# EAGLE schematic COVERsation_v0.3 (EAGLE 7.6.0)
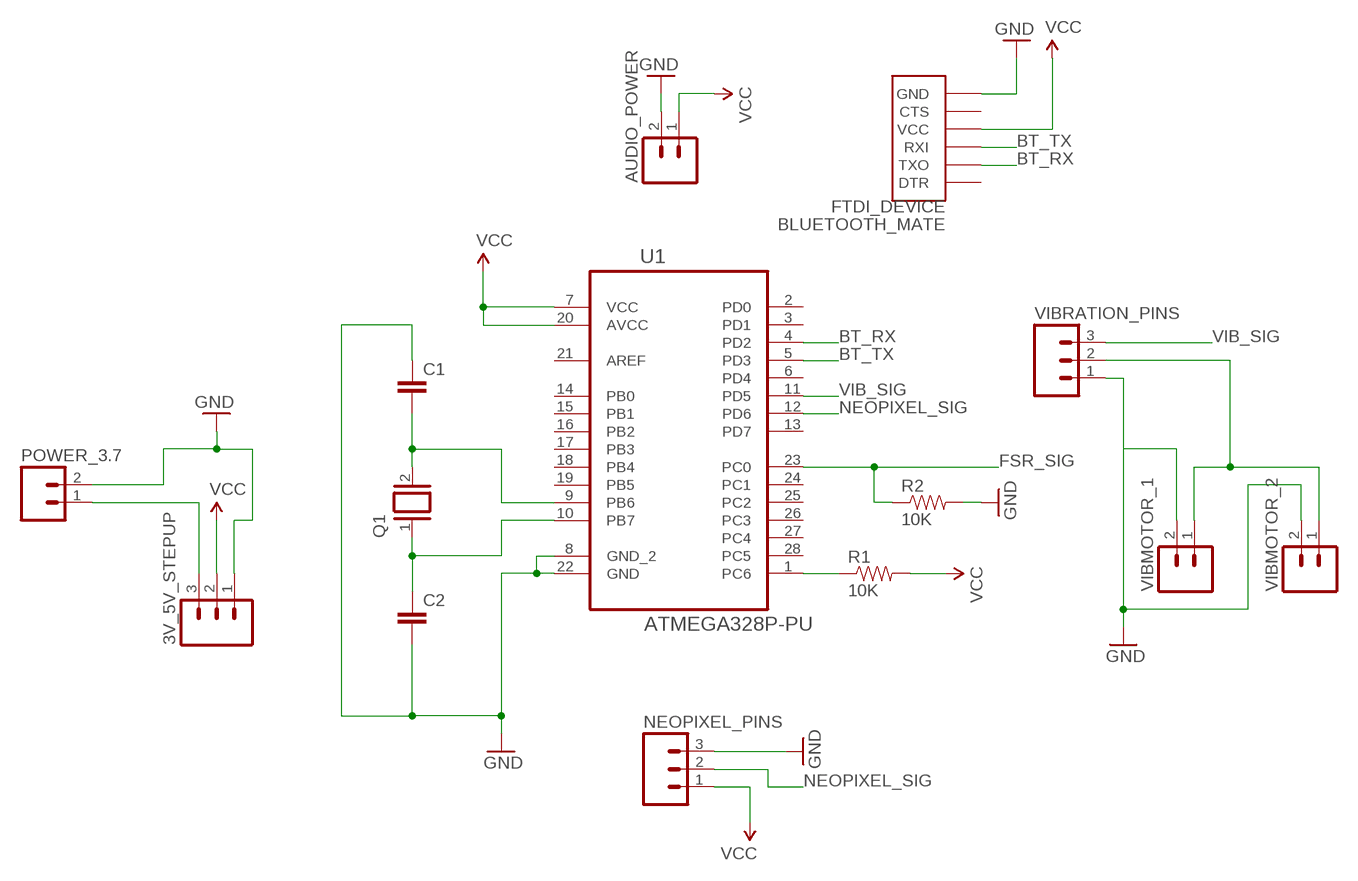
[diagram p0: schematic, sheet 1]

## Parts
3V_5V_STEPUP  M03PTH  [1X03]
AUDIO_POWER  M02PTH  [1X02]
BLUETOOTH_MATE  FTDI_DEVICE  [FTDI_DEVICE_SIDE]
C1  CAPPTH1  [CAP-PTH-5MM]
C2  CAPPTH1  [CAP-PTH-5MM]
NEOPIXEL_PINS  M03PTH  [1X03]
POWER_3.7  M02PTH  [1X02]
Q1  XTAL  [Q]
R1  10K  RESISTOREZ  [AXIAL-0.3EZ]
R2  10K  RESISTOREZ  [AXIAL-0.3EZ]
U1  ATMEGA328P-PU  [DIP254P762X457-28]
VIBMOTOR_1  M02PTH  [1X02]
VIBMOTOR_2  M02PTH  [1X02]
VIBRATION_PINS  M03PTH  [1X03]

## Nets
3.7_VCC [VCC]: 3V_5V_STEPUP.3 POWER_3.7.1
BT_RX: BLUETOOTH_MATE.P$2(TXO) U1.4(PD2)
BT_TX: BLUETOOTH_MATE.P$3(RXI) U1.5(PD3)
FSR_SIG: R2.P$1 U1.23(PC0)
GND [GND]: 3V_5V_STEPUP.1 AUDIO_POWER.2 BLUETOOTH_MATE.P$6(GND) C1.1 C2.2 NEOPIXEL_PINS.3 POWER_3.7.2 R2.P$2 U1.8(GND_2) U1.22(GND) VIBMOTOR_1.2 VIBMOTOR_2.2 VIBRATION_PINS.1
N$1: C1.2 Q1.2 U1.9(PB6)
N$2: C2.1 Q1.1 U1.10(PB7)
N$4: R1.P$1 U1.1(PC6)
N$5 [VCC]: VIBMOTOR_1.1 VIBMOTOR_2.1 VIBRATION_PINS.2
NEOPIXEL_SIG: NEOPIXEL_PINS.2 U1.12(PD6)
VCC: 3V_5V_STEPUP.2 AUDIO_POWER.1 BLUETOOTH_MATE.P$4(VCC) NEOPIXEL_PINS.1 R1.P$2 U1.7(VCC) U1.20(AVCC)
VIB_SIG: U1.11(PD5) VIBRATION_PINS.3
Unconnected: BLUETOOTH_MATE.P$1(DTR) BLUETOOTH_MATE.P$5(CTS) U1.2(PD0) U1.3(PD1) U1.6(PD4) U1.13(PD7) U1.14(PB0) U1.15(PB1) U1.16(PB2) U1.17(PB3) U1.18(PB4) U1.19(PB5) U1.21(AREF) U1.24(PC1) U1.25(PC2) U1.26(PC3) U1.27(PC4) U1.28(PC5)

## Library data of the parts
3V_5V_STEPUP NEOPIXEL_PINS VIBRATION_PINS = SparkFun-Connectors:M03: Header 3 Standard 3-pin 0.1" header. Use with straight break away headers (SKU : PRT-00116), right angle break away headers (PRT-00553), swiss pins (PRT-00743), machine pins (PRT-00117), and female headers (PRT-00115). Molex polarized connector foot print use with SKU : PRT-08232 with associated crimp pins and housings.
AUDIO_POWER POWER_3.7 VIBMOTOR_1 VIBMOTOR_2 = SparkFun-Connectors:M02: Standard 2-pin 0.1" header. Use with - straight break away headers ( PRT-00116) - right angle break away headers (PRT-00553) - swiss pins (PRT-00743) - machine pins (PRT-00117) - female headers (PRT-00115) Molex polarized connector foot print use with: PRT-08233 with associated crimp pins and housings. 2.54_SCREWTERM for use with PRT-10571. 3.5mm Screw Terminal footprints for PRT-08084 5mm Screw Terminal footprints for use with PRT-08432
BLUETOOTH_MATE = SparkFun-Connectors:FTDI_DEVICE: Connector which mates to FTDI basic or FTDI cable.
C1 C2 = SparkFun-Capacitors:CAP: Capacitor Standard 0603 ceramic capacitor, and 0.1" leaded capacitor.
Q1 = special:XTAL: CRYSTAL
R1 R2 = SparkFun-Passives:RESISTOR: Resistor Basic schematic elements and footprints for 0603, 1206, and PTH resistors.
U1 = Atmel_By_element14_Batch_1-00:ATMEGA328P-PU: 8-bit Microcontroller with In-System Programmable Flash; MPN: ATMEGA328P-PU; OC_FARNELL: 1715487; OC_NEWARK: 15R0268; PACKAGE: PDIP-28; SUPPLIER: Atmel

## Net classes
0 default: width 0.203 mm, drill 0.203 mm, clearance 0.203 mm
1 GND: width 0.203 mm, drill 0.203 mm, clearance 0.203 mm to class 0, clearance 0.203 mm
2 VCC: width 0.203 mm, drill 0.203 mm, clearance 0.203 mm to class 0, clearance 0.203 mm to class 1, clearance 0.203 mm